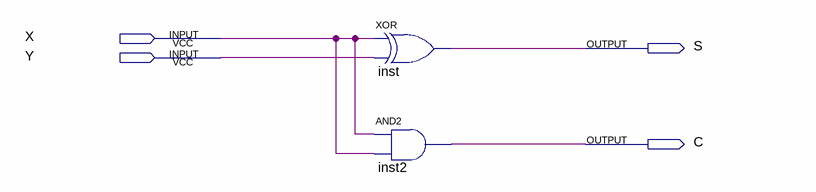
[diagram p0: schematic sheet]
// Quartus schematic Meio-Somador.bdf as structural Verilog: 2 symbols, 4 pins
module \Meio-Somador  (
  input  X,
  input  Y,
  output S,
  output C
);

  xor inst (S, X, Y);
  and inst2 (C, X, X);
endmodule
